# EAGLE design madrescheda (EAGLE 5.09)

## Sheet 1 of 3
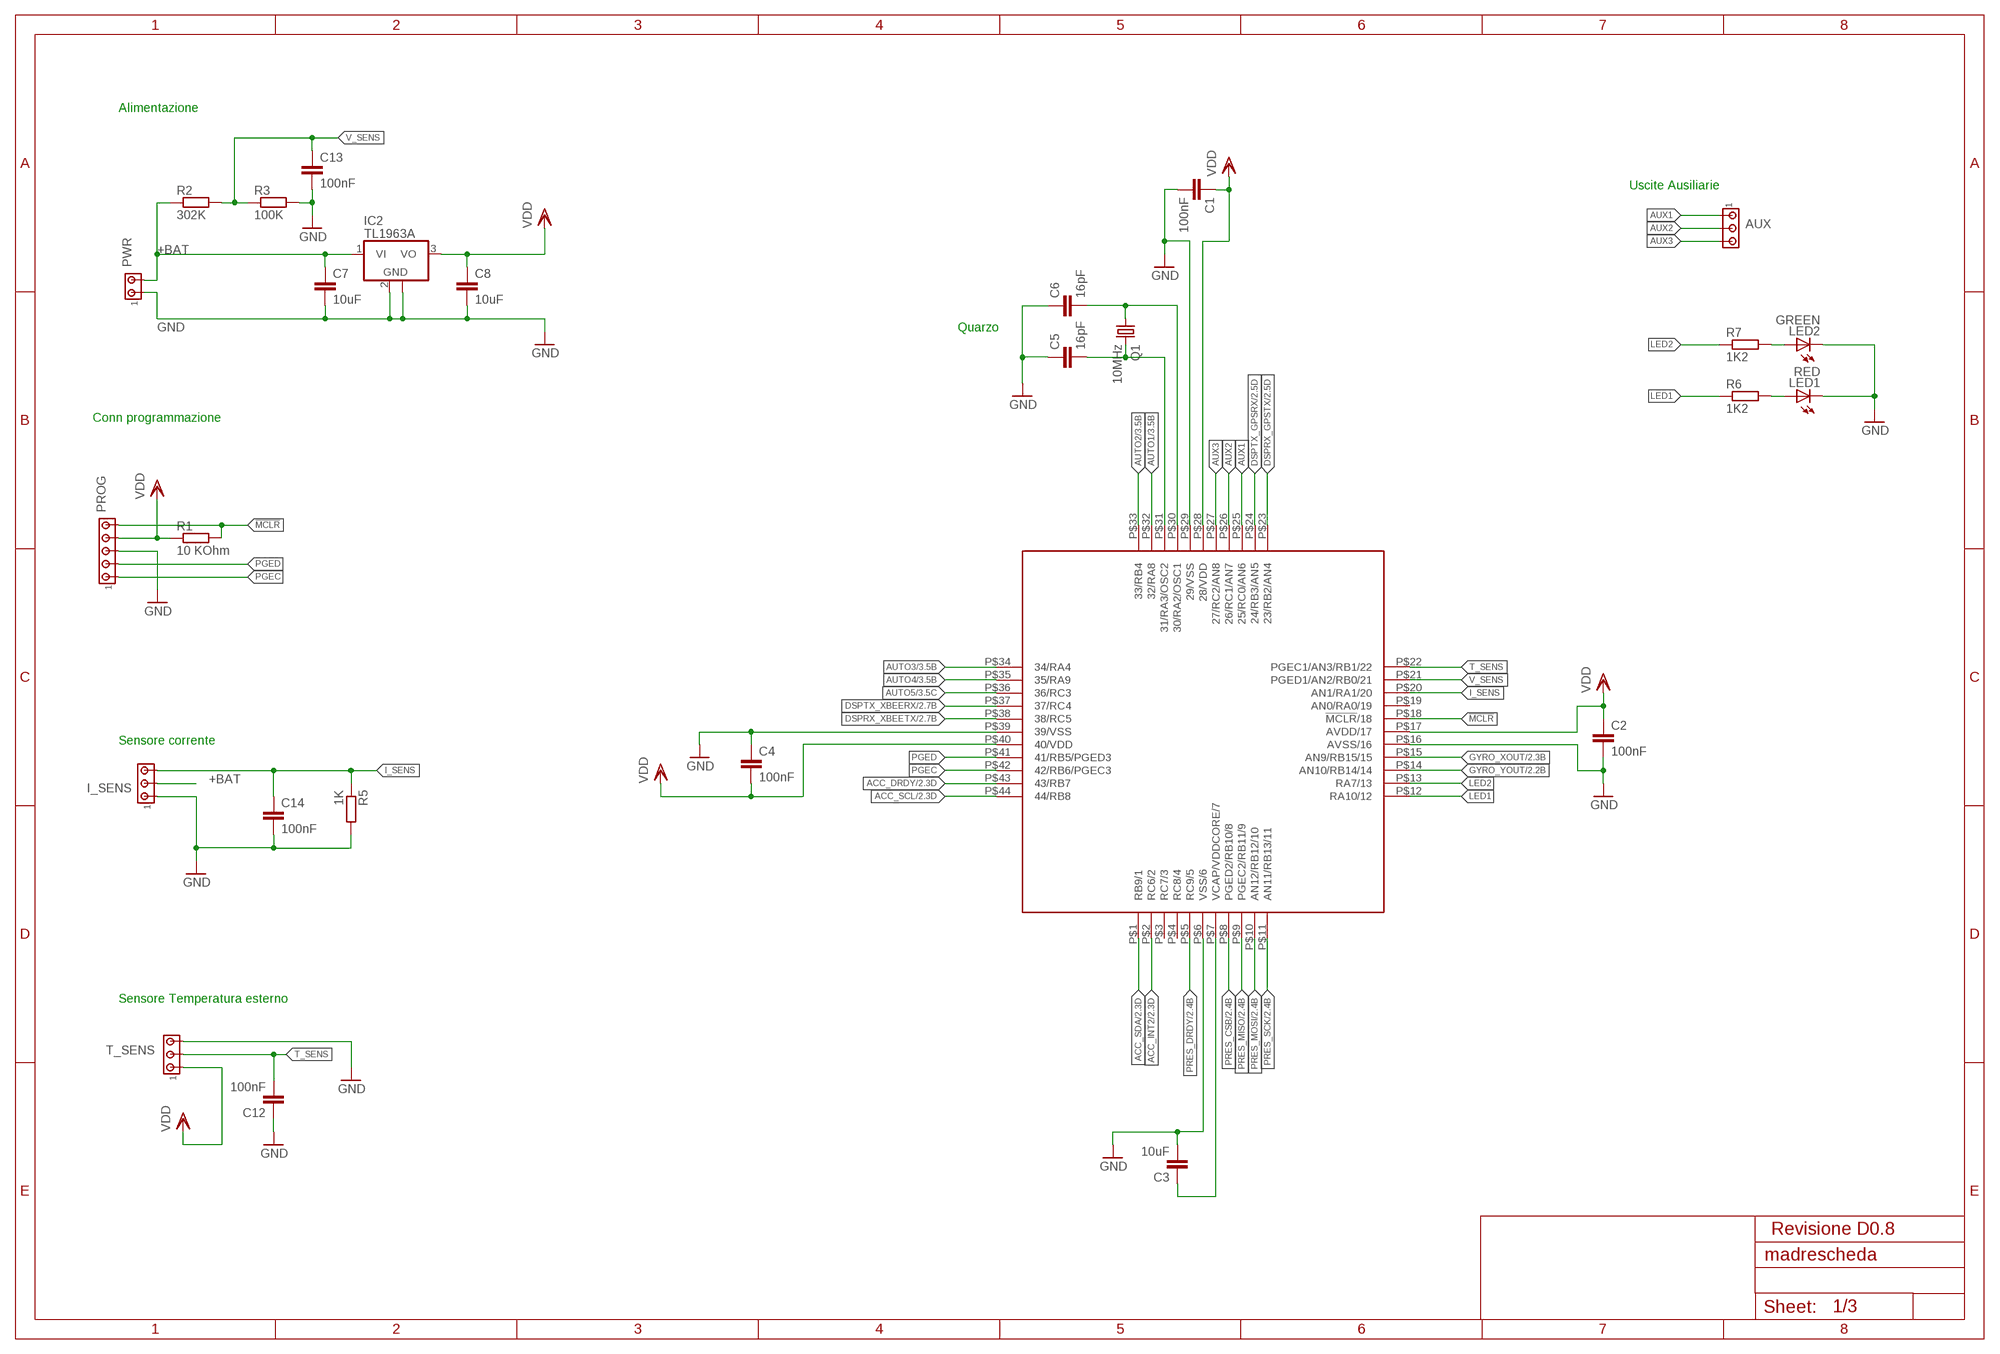
[diagram p0: schematic, sheet 1]

### Parts
AUX  MTA03-100  [10X03MTA]
C1  100nF  C-EUC0805K  [C0805K]
C2  100nF  C-EUC0805K  [C0805K]
C3  10uF  C-EUC0805K  [C0805K]
C4  100nF  C-EUC0805K  [C0805K]
C5  16pF  C-EUC0805K  [C0805K]
C6  16pF  C-EUC0805K  [C0805K]
C7  10uF  C-EUC0805K  [C0805K]
C8  10uF  C-EUC0805K  [C0805K]
C12  100nF  C-EUC0805K  [C0805K]
C13  100nF  C-EUC0805K  [C0805K]
C14  100nF  C-EUC0805K  [C0805K]
I_SENS  MTA03-100  [10X03MTA]
IC1  DSPIC33FJ128GP804TQFP  [DSPIC33FJ128GP804]
IC2  TL1963A  UA78M05DCY  [SOT223]
LED1  RED  LEDLSU260  [LSU260]
LED2  GREEN  LEDLSU260  [LSU260]
PROG  MTA05-100  [10X05MTA]
PWR  MTA02-100  [10X02MTA]
Q1  10MHz  CRYSTALHC49S  [HC49/S]
R1  10 KOhm  R-EU_0204/2V  [0204V]
R2  302K  R-EU_0204/2V  [0204V]
R3  100K  R-EU_0204/2V  [0204V]
R5  1K  R-EU_0204/2V  [0204V]
R6  1K2  R-EU_0204/2V  [0204V]
R7  1K2  R-EU_0204/2V  [0204V]
T_SENS  MTA03-100  [10X03MTA]

### Nets
!MCLR!: IC1.P$18(!MCLR!/18) PROG.5 R1.2
+BAT: C7.1 I_SENS.2 IC2.1(VI) PWR.2 R2.1
ACC_DRDY: IC1.P$43(43/RB7) ; also sheet 2
ACC_INT2: IC1.P$2(RC6/2) ; also sheet 2
ACC_SCL: IC1.P$44(44/RB8) ; also sheet 2
ACC_SDA: IC1.P$1(RB9/1) ; also sheet 2
AUTO1: IC1.P$32(32/RA8) ; also sheet 3
AUTO2: IC1.P$33(33/RB4) ; also sheet 3
AUTO3: IC1.P$34(34/RA4) ; also sheet 3
AUTO4: IC1.P$35(35/RA9) ; also sheet 3
AUTO5: IC1.P$36(36/RC3) ; also sheet 3
AUX1: AUX.1 IC1.P$25(25/RC0/AN6)
AUX2: AUX.2 IC1.P$26(26/RC1/AN7)
AUX3: AUX.3 IC1.P$27(27/RC2/AN8)
DSPRX_GPSTX: IC1.P$23(23/RB2/AN4) ; also sheet 2
DSPRX_XBEETX: IC1.P$38(38/RC5) ; also sheet 2
DSPTX_GPSRX: IC1.P$24(24/RB3/AN5) ; also sheet 2
DSPTX_XBEERX: IC1.P$37(37/RC4) ; also sheet 2
GND: C1.2 C2.2 C3.2 C4.1 C5.1 C6.1 C7.2 C8.2 C12.1 C13.2 C14.2 I_SENS.1 IC1.P$6(VSS/6) IC1.P$16(AVSS/16) IC1.P$29(29/VSS) IC1.P$39(39/VSS) IC2.2(GND) IC2.4(GND) LED1.K(C) LED2.K(C) PROG.3 PWR.1 R3.2 R5.2 T_SENS.3 ; also sheet 2,3
GYRO_XOUT: IC1.P$15(AN9/RB15/15) ; also sheet 2
GYRO_YOUT: IC1.P$14(AN10/RB14/14) ; also sheet 2
I_SENS: C14.1 I_SENS.3 IC1.P$20(AN1/RA1/20) R5.1
LED1: IC1.P$12(RA10/12) R6.1
LED2: IC1.P$13(RA7/13) R7.1
N$1: C3.1 IC1.P$7(VCAP/VDDCORE/7)
N$2: C6.2 IC1.P$30(30/RA2/OSC1) Q1.1
N$5: C5.2 IC1.P$31(31/RA3/OSC2) Q1.2
N$6: LED2.A R7.2
N$7: LED1.A R6.2
PGEC: IC1.P$42(42/RB6/PGEC3) PROG.1
PGED: IC1.P$41(41/RB5/PGED3) PROG.2
PRES_CSB: IC1.P$8(PGED2/RB10/8) ; also sheet 2
PRES_DRDY: IC1.P$5(RC9/5) ; also sheet 2
PRES_MISO: IC1.P$9(PGEC2/RB11/9) ; also sheet 2
PRES_MOSI: IC1.P$10(AN12/RB12/10) ; also sheet 2
PRES_SCK: IC1.P$11(AN11/RB13/11) ; also sheet 2
T_SENS: C12.2 IC1.P$22(PGEC1/AN3/RB1/22) T_SENS.2
V_SENS: C13.1 IC1.P$21(PGED1/AN2/RB0/21) R2.2 R3.1
VDD: C1.1 C2.1 C4.2 C8.1 IC1.P$17(AVDD/17) IC1.P$28(28/VDD) IC1.P$40(40/VDD) IC2.3(VO) PROG.4 R1.1 T_SENS.1 ; also sheet 2
Unconnected: IC1.P$3(RC7/3) IC1.P$4(RC8/4) IC1.P$19(AN0/RA0/19)

### Notes on the sheet
- Alimentazione
- Uscite Ausiliarie
- Quarzo
- Conn programmazione
- Sensore corrente
- Sensore Temperatura esterno
- Revisione D0.8

## Sheet 2 of 3
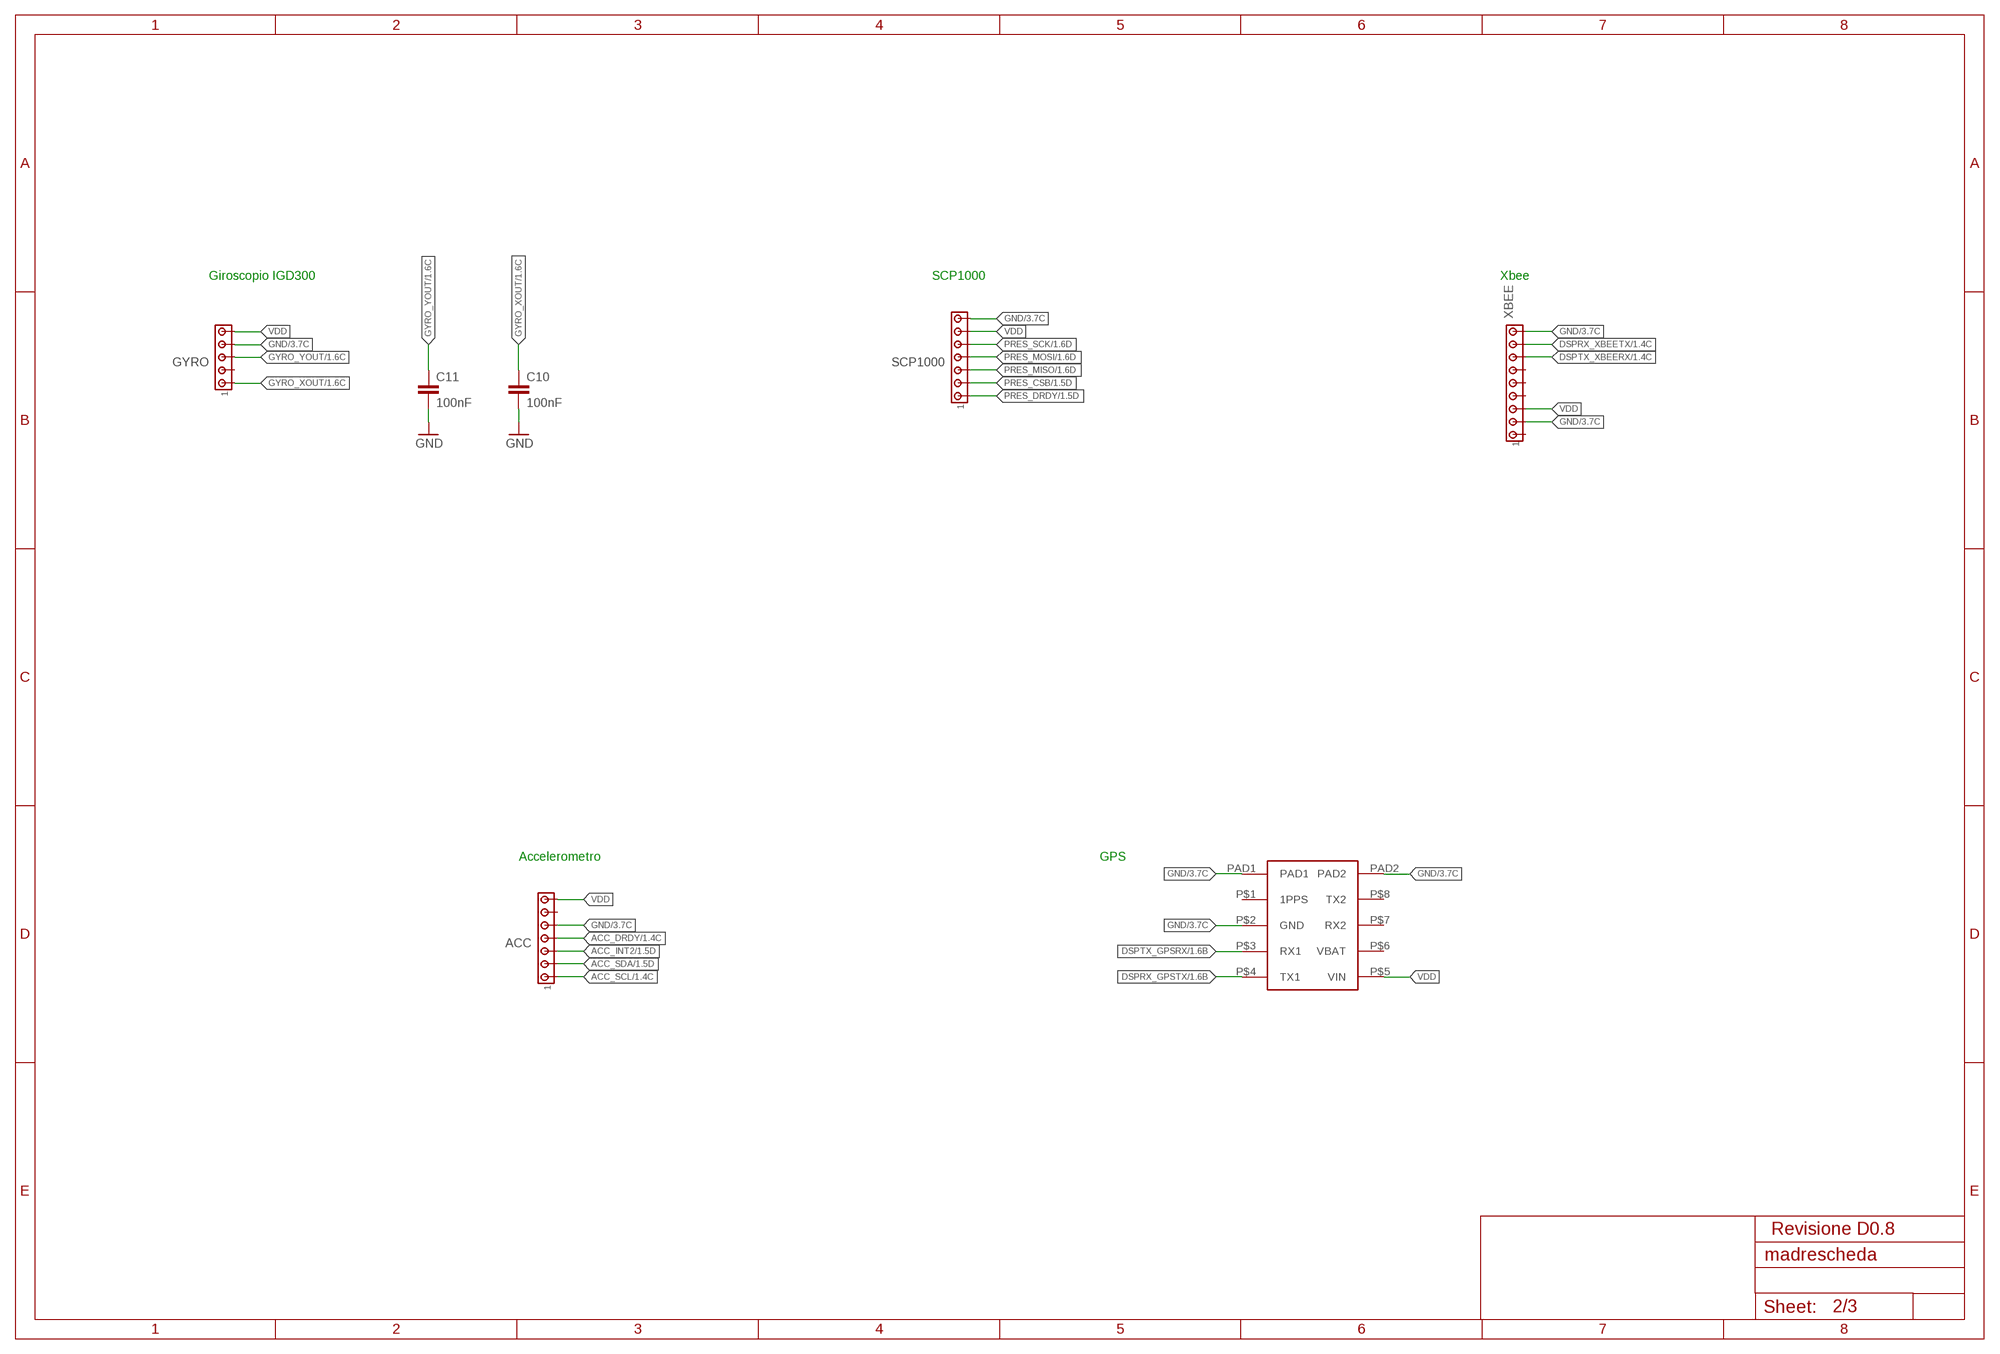
[diagram p1: schematic, sheet 2]

### Parts
ACC  MTA07-100  [10X07MTA]
C10  100nF  C-EUC0805K  [C0805K]
C11  100nF  C-EUC0805K  [C0805K]
GPS  CONN_FV-M8  [CONN_FV-M8_SMD]
GYRO  MTA05-100  [10X05MTA]
SCP1000  MTA07-100  [10X07MTA]
XBEE  MTA09-100  [10X09MTA]

### Nets
ACC_DRDY: ACC.4 ; also sheet 1
ACC_INT2: ACC.3 ; also sheet 1
ACC_SCL: ACC.1 ; also sheet 1
ACC_SDA: ACC.2 ; also sheet 1
DSPRX_GPSTX: GPS.P$4(TX1) ; also sheet 1
DSPRX_XBEETX: XBEE.8 ; also sheet 1
DSPTX_GPSRX: GPS.P$3(RX1) ; also sheet 1
DSPTX_XBEERX: XBEE.7 ; also sheet 1
GND: ACC.5 C10.2 C11.2 GPS.P$2(GND) GPS.PAD1 GPS.PAD2 GYRO.4 SCP1000.7 XBEE.2 XBEE.9 ; also sheet 1,3
GYRO_XOUT: C10.1 GYRO.1 ; also sheet 1
GYRO_YOUT: C11.1 GYRO.3 ; also sheet 1
PRES_CSB: SCP1000.2 ; also sheet 1
PRES_DRDY: SCP1000.1 ; also sheet 1
PRES_MISO: SCP1000.3 ; also sheet 1
PRES_MOSI: SCP1000.4 ; also sheet 1
PRES_SCK: SCP1000.5 ; also sheet 1
VDD: ACC.7 GPS.P$5(VIN) GYRO.5 SCP1000.6 XBEE.3 ; also sheet 1
Unconnected: ACC.6 GPS.P$1(1PPS) GPS.P$6(VBAT) GPS.P$7(RX2) GPS.P$8(TX2) GYRO.2 XBEE.1 XBEE.4 XBEE.5 XBEE.6

### Notes on the sheet
- Giroscopio IGD300 | SCP1000 | Xbee
- Accelerometro | GPS
- Revisione D0.8

## Sheet 3 of 3
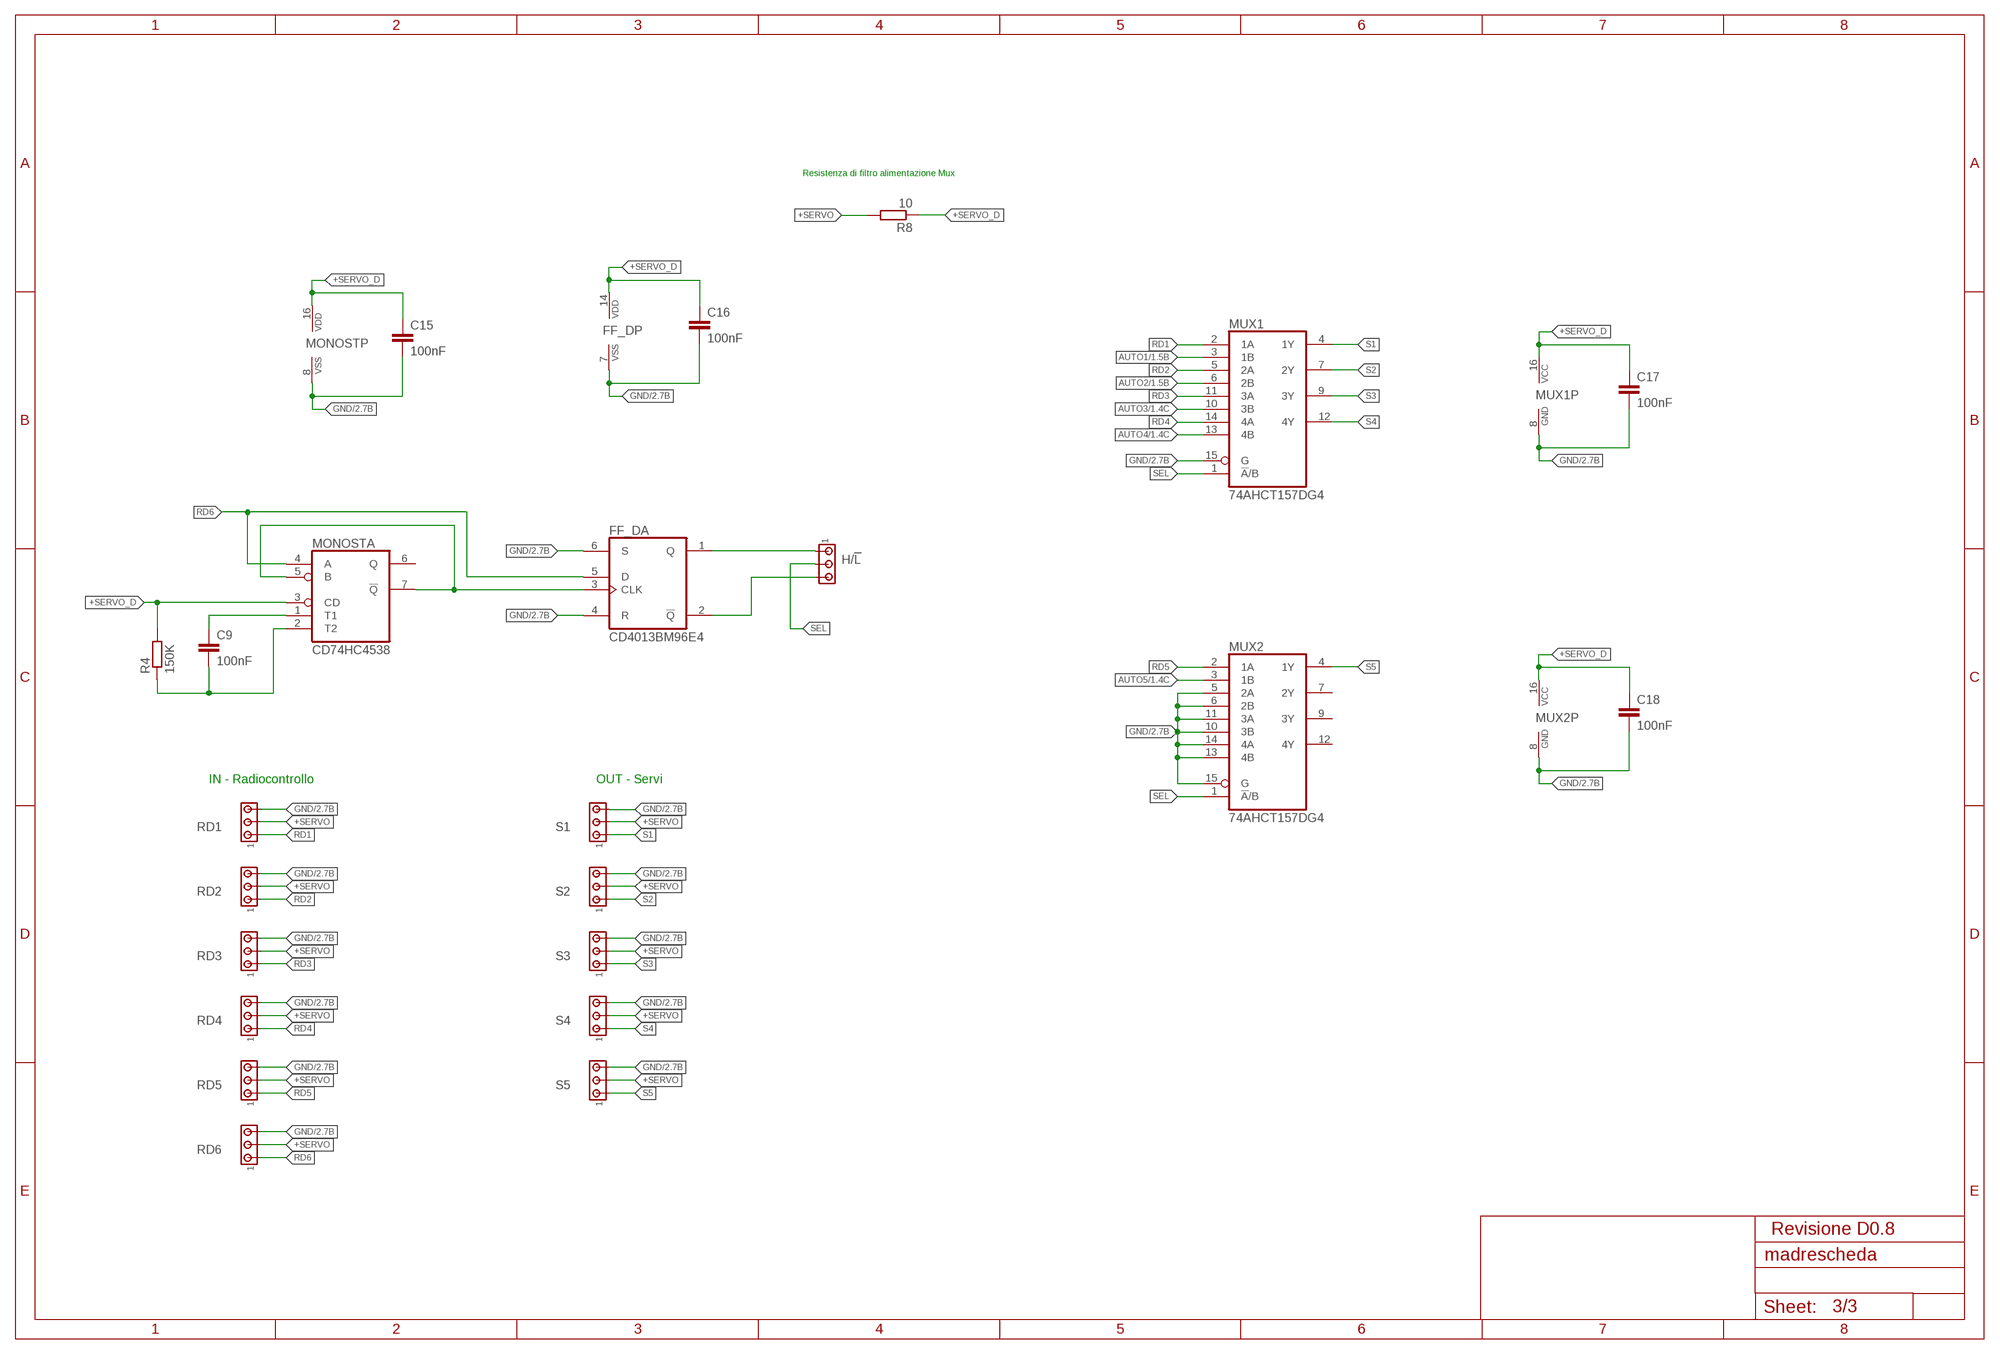
[diagram p2: schematic, sheet 3]

### Parts
C9  100nF  C-EUC0805K  [C0805K]
C15  100nF  C-EUC0805K  [C0805K]
C16  100nF  C-EUC0805K  [C0805K]
C17  100nF  C-EUC0805K  [C0805K]
C18  100nF  C-EUC0805K  [C0805K]
FF_D  CD4013BM96E4  4013D  [SO14]
H/!L  MTA03-100  [10X03MTA]
MONOST  CD74HC4538  4538D  [SO16]
MUX1  74AHCT157DG4  74AC257D  [SO16]
MUX2  74AHCT157DG4  74AC257D  [SO16]
R4  150K  R-EU_0204/2V  [0204V]
R8  10  R-EU_0204/2V  [0204V]
RD1  MTA03-100  [10X03MTA]
RD2  MTA03-100  [10X03MTA]
RD3  MTA03-100  [10X03MTA]
RD4  MTA03-100  [10X03MTA]
RD5  MTA03-100  [10X03MTA]
RD6  MTA03-100  [10X03MTA]
S1  MTA03-100  [10X03MTA]
S2  MTA03-100  [10X03MTA]
S3  MTA03-100  [10X03MTA]
S4  MTA03-100  [10X03MTA]
S5  MTA03-100  [10X03MTA]

### Nets
+SERVO: R8.2 RD1.2 RD2.2 RD3.2 RD4.2 RD5.2 RD6.2 S1.2 S2.2 S3.2 S4.2 S5.2
+SERVO_D: C15.1 C16.1 C17.1 C18.1 FF_D.14(P:VDD) MONOST.3(A:CD) MONOST.16(P:VDD) MUX1.16(VCC) MUX2.16(VCC) R4.2 R8.1
AUTO1: MUX1.3(1B) ; also sheet 1
AUTO2: MUX1.6(2B) ; also sheet 1
AUTO3: MUX1.10(3B) ; also sheet 1
AUTO4: MUX1.13(4B) ; also sheet 1
AUTO5: MUX2.3(1B) ; also sheet 1
CLK: FF_D.3(A:CLK) MONOST.5(A:B) MONOST.7(A:!Q)
GND: C15.2 C16.2 C17.2 C18.2 FF_D.4(A:R) FF_D.6(A:S) FF_D.7(P:VSS) MONOST.8(P:VSS) MUX1.8(GND) MUX1.15(G) MUX2.5(2A) MUX2.6(2B) MUX2.8(GND) MUX2.10(3B) MUX2.11(3A) MUX2.13(4B) MUX2.14(4A) MUX2.15(G) RD1.3 RD2.3 RD3.3 RD4.3 RD5.3 RD6.3 S1.3 S2.3 S3.3 S4.3 S5.3 ; also sheet 1,2
N$9: C9.2 MONOST.2(A:T2) R4.1
N$10: C9.1 MONOST.1(A:T1)
N$13: FF_D.1(A:Q) H/!L.1
N$14: FF_D.2(A:!Q) H/!L.3
RD1: MUX1.2(1A) RD1.1
RD2: MUX1.5(2A) RD2.1
RD3: MUX1.11(3A) RD3.1
RD4: MUX1.14(4A) RD4.1
RD5: MUX2.2(1A) RD5.1
RD6: FF_D.5(A:D) MONOST.4(A:A) RD6.1
S1: MUX1.4(1Y) S1.1
S2: MUX1.7(2Y) S2.1
S3: MUX1.9(3Y) S3.1
S4: MUX1.12(4Y) S4.1
S5: MUX2.4(1Y) S5.1
SEL: H/!L.2 MUX1.1(!A!/B) MUX2.1(!A!/B)
Unconnected: FF_D.8(B:S) FF_D.9(B:D) FF_D.10(B:R) FF_D.11(B:CLK) FF_D.12(B:!Q) FF_D.13(B:Q) MONOST.6(A:Q) MONOST.9(B:!Q) MONOST.10(B:Q) MONOST.11(B:B) MONOST.12(B:A) MONOST.13(B:CD) MONOST.14(B:T2) MONOST.15(B:T1) MUX2.7(2Y) MUX2.9(3Y) MUX2.12(4Y)

### Notes on the sheet
- Resistenza di filtro alimentazione Mux
- IN - Radiocontrollo | OUT - Servi
- Revisione D0.8

## Library data of the parts
ACC SCP1000 = con-amp:MTA07-100: AMP connector
AUX H/!L I_SENS RD1-RD6 S1-S5 T_SENS = con-amp:MTA03-100: AMP connector
C1-C4 C7 C8 C13 C14 = resistor:C-EU: CAPACITOR, European symbol
C5 C6 C9-C12 C15-C18 = rcl:C-EU: CAPACITOR, European symbol
FF_D = 40xx:4013: Dual D FLIP FLOP, set/reset
GPS = gps:CONN_FV-M8
GYRO PROG = con-amp:MTA05-100: AMP connector
IC1 = UavComp:DSPIC33FJ128GP804: dsPic33fl128GP804
IC2 = linear:UA78M*: POSITIVE-VOLTAGE REGULATORS Source: http://focus.ti.com/lit/ds/symlink/ua78m33.pdf
LED1 LED2 = led:LED: LED OSRAM: - CHIPLED LG R971, LG N971, LY N971, LG Q971, LY Q971, LO R971, LY R971 LH N974, LH R974 LS Q976, LO Q976, LY Q976 LO Q996 - Hyper CHIPLED LW Q18S LB Q993, LB Q99A, LB R99A - SideLED LS A670, LO A670, LY A670, LG A670, LP A670 LB A673, LV A673, LT A673, LW A673 LH A674 LY A675 LS A676, LA A676, LO A676, LY A676, LW A676 LS A679, LY A679, LG A679 - Hyper Micro SIDELED® LS Y876, LA Y876, LO Y876, LY Y876 LT Y87S - SmartLED LW L88C, LW L88S LB L89C, LB L89S, LG L890 LS L89K, LO L89K, LY L89K LS L896, LA L896, LO L896, LY L896 - TOPLED LS T670, LO T670, LY T670, LG T670, LP T670 LSG T670, LSP T670, LSY T670, LOP T670, LYG T670 LG T671, LOG T671, LSG T671 LB T673, LV T673, LT T673, LW T673 LH T674 LS T676, LA T676, LO T676, LY T676, LB T676, LH T676, LSB T676, LW T676 LB T67C, LV T67C, LT T67C, LS T67K, LO T67K, LY T67K, LW E67C LS E67B, LA E67B, LO E67B, LY E67B, LB E67C, LV E67C, LT E67C LW T67C LS T679, LY T679, LG T679 LS T770, LO T770, LY T770, LG T770, LP T770 LB T773, LV T773, LT T773, LW T773 LH T774 LS E675, LA E675, LY E675, LS T675 LS T776, LA T776, LO T776, LY T776, LB T776 LHGB T686 LT T68C, LB T68C - Hyper Mini TOPLED® LB M676 - Mini TOPLED Santana® LG M470 LS M47K, LO M47K, LY M47K Source: http://www.osram.convergy.de LUXEON: - LUMILED® LXK2-PW12-R00, LXK2-PW12-S00, LXK2-PW14-U00, LXK2-PW14-V00 LXK2-PM12-R00, LXK2-PM12-S00, LXK2-PM14-U00 LXK2-PE12-Q00, LXK2-PE12-R00, LXK2-PE12-S00, LXK2-PE14-T00, LXK2-PE14-U00 LXK2-PB12-K00, LXK2-PB12-L00, LXK2-PB12-M00, LXK2-PB14-N00, LXK2-PB14-P00, LXK2-PB14-Q00 LXK2-PR12-L00, LXK2-PR12-M00, LXK2-PR14-Q00, LXK2-PR14-R00 LXK2-PD12-Q00, LXK2-PD12-R00, LXK2-PD12-S00 LXK2-PH12-R00, LXK2-PH12-S00 LXK2-PL12-P00, LXK2-PL12-Q00, LXK2-PL12-R00 Source: www.luxeon.com KINGBRIGHT: KA-3528ASYC Source: www.kingbright.com
MONOST = 45xx:4538: Dual precision monostable MULTIVIBRATOR
MUX1 MUX2 = 74xx-eu:74*257: Quadruple 2-to 1 line data SELECTOR/MULTIPLEXER
PWR = con-amp:MTA02-100: AMP connector
Q1 = crystal:CRYSTAL: CRYSTAL
R1-R8 = rcl:R-EU_: RESISTOR, European symbol
XBEE = con-amp:MTA09-100: AMP connector

## Board
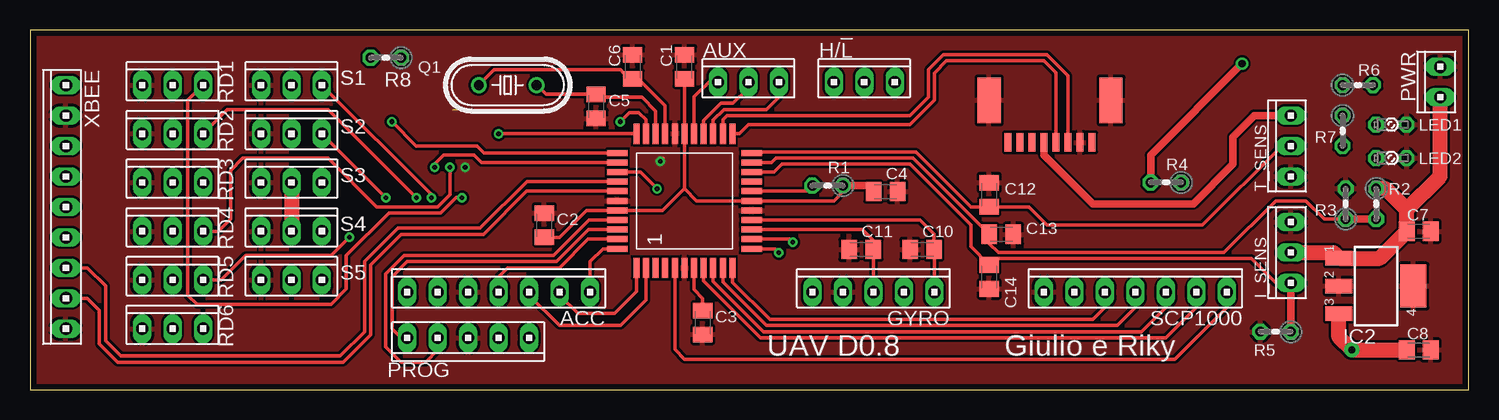
[diagram p3: board, top side]
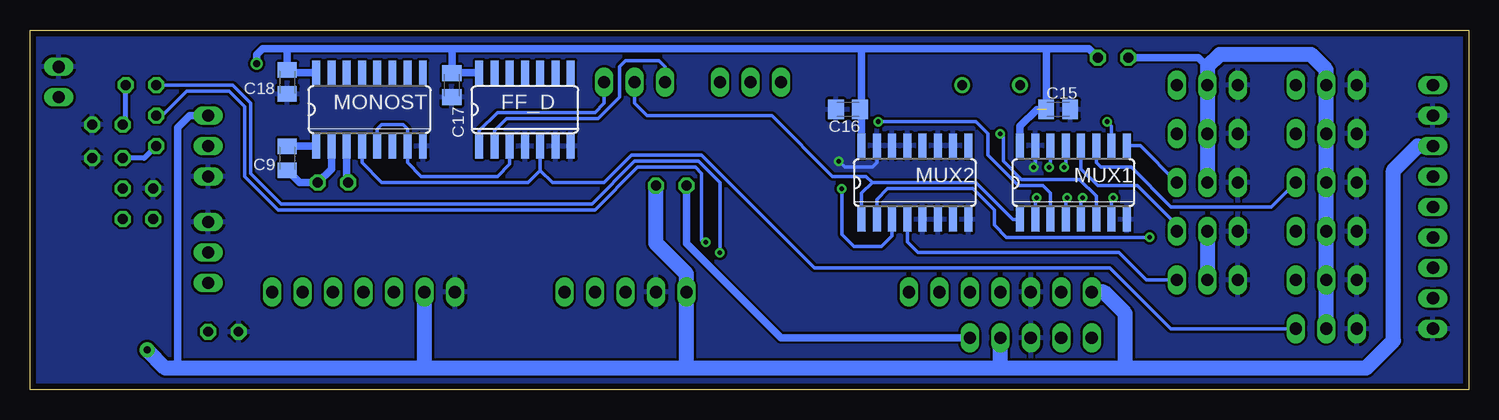
[diagram p4: board, bottom side, seen from below]

Size 119.95 x 30 mm. Coordinates in mm from the lower left corner, seen from the top.
Outline: 119.95,0 119.95,30 0,30 0,0 119.95,0
Copper layers (1*16): Top 0.035mm / dielectric 1.5mm / Bottom 0.035mm
Design rules "default *": minimum track width 10mil, minimum drill 15mil, track to track 8mil, track to pad 8mil, pad to pad 8mil, via to via 8mil, smd to smd 8mil, copper to edge 20mil, drill to drill 8mil, minimum pad ring 10mil, minimum via ring 8mil, stop-mask expansion 4mil, vias tented up to drill 0mil, thermal gap 10mil

### Footprints (pad centres in the part's own frame; a part is rotated, then mirrored left to right if it is on the bottom)
10X07MTA = drill 1.016 long: 1 7.62,0; 2 5.08,0; 3 2.54,0; 4 0,0; 5 -2.54,0; 6 -5.08,0; 7 -7.62,0
10X03MTA = drill 1.016 long: 1 2.54,0; 2 0,0; 3 -2.54,0
C0805K = smd 1.3 x 1.6: 1 -1,0; 2 1,0
SO14 = smd 0.66 x 2.032: 1 -3.81,-3.073; 2 -2.54,-3.073; 3 -1.27,-3.073; 4 0,-3.073; 5 1.27,-3.073; 6 2.54,-3.073; 7 3.81,-3.073; 8 3.81,3.073; 9 2.54,3.073; 10 1.27,3.073; 11 0,3.073; 12 -1.27,3.073; 13 -2.54,3.073; 14 -3.81,3.073
CONN_FV-M8_SMD = smd 0.6 x 1.55: P$1 -4,3; P$2 -3,3; P$3 -2,3; P$4 -1,3; P$5 0,3; P$6 1,3; P$7 2,3; P$8 3,3 | smd 1.93 x 3.81: PAD1 -5.588,-0.508; PAD2 4.572,-0.508
10X05MTA = drill 1.016 long: 1 5.08,0; 2 2.54,0; 3 0,0; 4 -2.54,0; 5 -5.08,0
DSPIC33FJ128GP804 = smd 1.7 x 0.5: P$1 -5.6,4; P$2 -5.6,3.2; P$3 -5.6,2.4; P$4 -5.6,1.6; P$5 -5.6,0.8; P$6 -5.6,0; P$7 -5.6,-0.8; P$8 -5.6,-1.6; P$9 -5.6,-2.4; P$10 -5.6,-3.2; P$11 -5.6,-4; P$23 5.6,-4; P$24 5.6,-3.2; P$25 5.6,-2.4; P$26 5.6,-1.6; P$27 5.6,-0.8; P$28 5.6,0; P$29 5.6,0.8; P$30 5.6,1.6; P$31 5.6,2.4; P$32 5.6,3.2; P$33 5.6,4 | smd 0.5 x 1.7: P$12 -4,-5.6; P$13 -3.2,-5.6; P$14 -2.4,-5.6; P$15 -1.6,-5.6; P$16 -0.8,-5.6; P$17 0,-5.6; P$18 0.8,-5.6; P$19 1.6,-5.6; P$20 2.4,-5.6; P$21 3.2,-5.6; P$22 4,-5.6; P$34 4,5.6; P$35 3.2,5.6; P$36 2.4,5.6; P$37 1.6,5.6; P$38 0.8,5.6; P$39 0,5.6; P$40 -0.8,5.6; P$41 -1.6,5.6; P$42 -2.4,5.6; P$43 -3.2,5.6; P$44 -4,5.6
SOT223 = smd 1.219 x 2.235: 1 -2.311,-3.099; 2 0,-3.099; 3 2.311,-3.099 | smd 3.6 x 2.2: 4 0,3.099
LSU260 = drill 0.813 octagon: A -1.27,0; K 1.27,0
SO16 = smd 0.66 x 2.032: 1 -4.445,-3.073; 2 -3.175,-3.073; 3 -1.905,-3.073; 4 -0.635,-3.073; 5 0.635,-3.073; 6 1.905,-3.073; 7 3.175,-3.073; 8 4.445,-3.073; 9 4.445,3.073; 10 3.175,3.073; 11 1.905,3.073; 12 0.635,3.073; 13 -0.635,3.073; 14 -1.905,3.073; 15 -3.175,3.073; 16 -4.445,3.073
10X02MTA = drill 1.016 long: 1 1.27,0; 2 -1.27,0
HC49/S = drill 0.813 round: 1 -2.413,0; 2 2.413,0
0204V = drill 0.813 octagon: 1 -1.27,0; 2 1.27,0
10X09MTA = drill 1.016 long: 1 10.16,0; 2 7.62,0; 3 5.08,0; 4 2.54,0; 5 0,0; 6 -2.54,0; 7 -5.08,0; 8 -7.62,0; 9 -10.16,0

### Placement (x,y rotation side)
ACC  39.06,8.13 0 top
AUX  59.89,25.65 0 top
C1  54.56,26.92 90 top
C2  42.87,13.72 90 top
C3  56.08,5.59 270 top
C4  71.32,16.51 180 top
C5  47.19,23.62 90 top
C6  50.24,26.92 270 top
C7  115.77,13.21 0 top
C8  115.77,3.3 0 top
C9  98.5,19.3 270 bottom
C10  74.37,11.68 180 top
C11  69.29,11.68 180 top
C12  79.96,16.26 270 top
C13  80.97,12.95 0 top
C14  79.96,9.4 270 top
C15  34.24,23.37 0 bottom
C16  51.76,23.37 180 bottom
C17  84.78,25.4 270 bottom
C18  98.5,25.65 270 bottom
FF_D  78.69,23.37 0 bottom
GPS  84.53,23.62 180 top
GYRO  70.31,8.13 0 top
H/!L  69.54,25.65 0 top
I_SENS  105.1,11.43 90 top
IC1  54.56,15.75 90 top
IC2  112.22,8.64 270 top
LED1  113.49,22.1 0 top
LED2  113.49,19.3 0 top
MONOST  91.64,23.37 0 bottom
MUX1  32.97,17.27 0 bottom
MUX2  46.18,17.27 0 bottom
PROG  36.52,4.32 180 top
PWR  117.55,25.65 90 top
Q1  39.83,25.4 0 top
R1  66.5,17.02 180 top
R2  112.22,15.49 270 top
R3  109.68,15.49 90 top
R4  94.69,17.27 180 top
R5  103.83,4.83 180 top
R6  110.69,25.4 0 top
R7  109.42,21.59 270 top
R8  29.67,27.69 180 top
RD1  11.89,25.4 0 top
RD2  11.89,21.34 0 top
RD3  11.89,17.27 0 top
RD4  11.89,13.21 0 top
RD5  11.89,9.14 0 top
RD6  11.89,5.08 0 top
S1  21.79,25.4 0 top
S2  21.79,21.34 0 top
S3  21.79,17.27 0 top
S4  21.79,13.21 0 top
S5  21.79,9.14 0 top
SCP1000  92.15,8.13 0 top
T_SENS  105.1,20.32 90 top
XBEE  3,15.24 90 top

### Tracks (layer width: path | path; a pad name or v marks a point on that pad's centre or on a via)
!MCLR!
  Top 0.305: IC1.P$18 64.76,16.55 R1.2
  Bottom 0.61: R1.2 65.23,12.19 57.35,4.32 PROG.5
+BAT
  Top 1.27: 109.14,10.95 108.66,11.43 I_SENS.2 | PWR.2 117.55,17.78 114.77,15 | 109.14,10.95 IC2.1 | 109.14,10.95 112.51,10.95 C7.1 114.77,15 | R2.1 113.01,16.76 114.77,15
+SERVO
  Top 1.27: S3.2 S4.2
  Bottom 0.61: R8.2 22.55,27.69 21.79,26.92
  Bottom 1.27: RD6.2 RD5.2 RD4.2 RD3.2 RD2.2 RD1.2 11.89,26.67 13.16,27.94 20.78,27.94 21.79,26.92 S1.2 S2.2 S3.2 | S4.2 S5.2
+SERVO_D  (via drill 0.6)  (1 unrouted)
  Top 0.61: v101.04,27.18 93.42,19.56 R4.2
  Bottom 0.61: MUX1.16 37.41,21.97 36.02,23.37 | R8.1 31.7,28.45 35.25,28.45 | 35.25,28.45 50.75,28.45 | 50.75,28.45 84.53,28.45 | 84.53,28.45 98.5,28.45 | 84.74,26.44 84.74,28.23 84.53,28.45 | 84.74,26.44 FF_D.14 | 84.74,26.44 C17.1 | C15.1 35.24,28.43 35.25,28.45 | 98.5,28.45 C18.1 98.29,26.44 MONOST.16 | v101.04,27.18 101.04,27.94 100.53,28.45 98.5,28.45 | MONOST.3 93.55,17.4 R4.2 | 50.75,28.45 50.62,28.32 50.62,23.23 | MUX2.16 50.62,22.86 50.62,23.23 | 50.62,23.23 C16.1
ACC_DRDY
  Top 0.305: IC1.P$43 46.53,12.55 44.14,10.16 39.83,10.16 39.06,9.4 ACC.4
ACC_INT2
  Top 0.305: IC1.P$2 51.36,7.47 49.22,5.33 44.14,5.33 41.6,7.87 ACC.3
ACC_SCL
  Top 0.305: IC1.P$44 47.76,11.75 46.68,10.67 ACC.1
ACC_SDA
  Top 0.305: IC1.P$1 50.56,8.19 48.72,6.35 45.67,6.35 44.14,7.87 ACC.2
AUTO1  (via drill 0.38)
  Top 0.305: IC1.P$32 51.36,22.5 50.75,23.11 49.99,23.11 v49.22,22.35
  Bottom 0.305: v49.22,22.35 41.1,22.35 40.08,21.34 40.08,19.56 37.54,17.02 35.51,17.02 34.87,16.38 MUX1.3
AUTO2  (via drill 0.38)
  Top 0.305: v39.06,21.34 50.55,21.34 IC1.P$33
  Bottom 0.305: v39.06,21.34 38.81,21.08 38.81,19.05 37.29,17.53 32.46,17.53 31.06,16.13 MUX1.6
AUTO3  (via drill 0.38)
  Top 0.305: IC1.P$34 37.86,19.75 37.29,20.32 32.21,20.32 v30.17,22.35
  Bottom 0.305: MUX1.10 29.79,21.97 v30.17,22.35
AUTO4  (via drill 0.38)
  Top 0.305: IC1.P$35 37.64,18.95 37.03,19.56 34.49,19.56 33.73,18.8 v33.73,18.54
  Bottom 0.305: MUX1.13 33.6,18.67 v33.73,18.54
AUTO5  (via drill 0.38)
  Top 0.305: IC1.P$36 50.89,18.15 v52.27,16.76
  Bottom 0.305: v52.27,16.76 52.27,12.95 51.26,11.94 48.97,11.94 48.08,12.83 MUX2.3
AUX1
  Top 0.305: IC1.P$25 56.96,22.47 57.86,23.37 61.42,23.37 62.43,24.38 AUX.1
AUX2
  Top 0.305: IC1.P$26 56.16,22.43 57.61,23.88 58.62,23.88 59.89,25.15 AUX.2
AUX3
  Top 0.305: IC1.P$27 55.36,24.42 56.59,25.65 AUX.3
CLK
  Bottom 0.305: FF_D.3 79.96,18.8 80.97,17.78 87.32,17.78 88.47,18.92 MONOST.7 88.47,21.72 88.85,22.1 90.63,22.1 91.01,21.72 MONOST.5
DSPRX_GPSTX
  Top 0.305: IC1.P$23 59.14,21.35 59.89,22.1 73.35,22.1 75.39,24.13 75.39,26.42 76.4,27.43 84.53,27.43 85.53,26.43 GPS.P$4
DSPRX_XBEETX
  Top 0.305: XBEE.8 4.77,7.62 5.79,6.6 5.79,3.81 7.31,2.29 26.11,2.29 28.4,4.57 28.4,10.41 30.94,12.95 37.79,12.95 41.39,16.55 IC1.P$38
DSPTX_GPSRX
  Top 0.305: GPS.P$3 86.53,26.19 84.78,27.94 76.15,27.94 74.88,26.67 74.88,24.38 73.35,22.86 58.11,22.86 57.76,22.5 IC1.P$24
DSPTX_XBEERX
  Top 0.305: XBEE.7 4.77,10.16 6.3,8.64 6.3,4.06 7.57,2.79 25.86,2.79 27.89,4.83 27.89,10.67 30.68,13.46 37.54,13.46 41.43,17.35 IC1.P$37
GND  (via drill 0.38)
  Top 0.305: v36.27,18.54 36.52,18.54 | v52.53,19.05 52.78,19.3
  Bottom 0.305: MUX1.15 36.14,18.67 v36.27,18.54 | MUX2.15 49.35,18.92 49.73,18.54 52.02,18.54 v52.53,19.05
  pour Bottom: -0.05,30 119.95,30 119.95,0 -0.05,0
  pour Top: -0.05,30 119.95,30 119.95,0 -0.05,0
GYRO_XOUT
  Top 0.305: IC1.P$15 74.19,14.15 75.37,12.97 C10.1 75.39,11.67 GYRO.1
GYRO_YOUT
  Top 0.305: IC1.P$14 69.4,13.35 70.29,12.46 C11.1 70.31,11.67 GYRO.3
I_SENS
  Top 0.305: IC1.P$20 62.04,18.15 62.69,18.8 73.35,18.8 78.43,13.72 78.43,11.92 C14.1 80.48,10.92 101.8,10.92 103.83,8.89 I_SENS.3
  Top 0.61: I_SENS.3 R5.1
LED1  (via drill 0.38)
  Top 0.305: IC1.P$12 62.11,11.75 v62.43,11.43
  Bottom 0.305: v62.43,11.43 62.43,17.27 64.21,19.05 69.54,19.05 73.1,15.49 99.01,15.49 101.55,18.03 101.55,23.88 103.07,25.4 R6.1
LED2  (via drill 0.38)
  Top 0.305: IC1.P$13 63.35,12.55 v63.6,12.29
  Bottom 0.305: v63.6,12.29 63.8,12.29 63.96,12.45 63.96,18.03 64.46,18.54 69.29,18.54 72.85,14.99 99.26,14.99 102.06,17.78 102.06,23.62 103.33,24.89 106.88,24.89 108.91,22.86 R7.1
N$1
  Top 0.305: IC1.P$7 55.36,8.34 56.08,7.62 C3.1
N$2
  Top 0.305: IC1.P$30 52.96,23.7 50.75,25.91 50.26,25.91 C6.2 49.75,26.42 49.48,26.42 49.22,26.67 38.68,26.67 Q1.1
N$5
  Top 0.305: IC1.P$31 52.16,23.23 51,24.38 47.43,24.38 C5.2 47.18,24.64 43,24.64 Q1.2
N$6
  Bottom 0.406: R7.2 110.44,19.3 LED2.A
N$7
  Bottom 0.406: LED1.A 111.96,22.35 R6.2
N$9
  Bottom 0.61: MONOST.2 94.82,18.41 R4.1 97.47,17.27 C9.2
N$10
  Bottom 0.61: MONOST.1 C9.1
N$13
  Bottom 0.305: H/!L.1 72.08,23.88 72.85,23.11 80.97,23.11 82.5,21.59 FF_D.1
N$14
  Bottom 0.305: FF_D.2 81.23,21.59 80.21,22.61 72.59,22.61 70.81,24.38 70.81,26.92 70.31,27.43 67.51,27.43 67,26.92 H/!L.3
PGEC
  Top 0.305: IC1.P$42 46.57,13.35 43.89,10.67 31.44,10.67 30.17,9.4 30.17,5.08 30.94,4.32 PROG.1
PGED
  Top 0.305: IC1.P$41 46.61,14.15 43.64,11.18 31.19,11.18 29.67,9.65 29.67,3.56 30.94,2.29 32.97,2.29 33.98,3.3 PROG.2
PRES_CSB
  Top 0.305: IC1.P$8 56.16,9.07 60.91,4.32 94.69,4.32 97.23,6.86 SCP1000.2
PRES_DRDY
  Top 0.305: IC1.P$5 53.76,3.34 54.56,2.54 95.45,2.54 99.77,6.86 SCP1000.1
PRES_MISO
  Top 0.305: IC1.P$9 56.96,9.03 61.16,4.83 92.66,4.83 94.69,6.86 SCP1000.3
PRES_MOSI
  Top 0.305: IC1.P$10 57.76,8.99 61.42,5.33 90.63,5.33 92.15,6.86 SCP1000.4
PRES_SCK
  Top 0.305: IC1.P$11 58.56,8.95 61.67,5.84 88.59,5.84 89.61,6.86 SCP1000.5
RD1  (via drill 0.38)
  Top 0.305: RD1.1 13.16,24.13 13.16,7.87 13.92,7.11 25.09,7.11 26.36,8.38 26.36,11.18 29.92,14.73 34.24,14.73 35.51,16 v36.02,16
  Bottom 0.305: MUX1.2 36.14,15.88 v36.02,16
RD2  (via drill 0.38)
  Top 0.305: v32.21,16 24.84,23.37 16.46,23.37 RD2.1
  Bottom 0.305: MUX1.5 32.33,15.88 v32.21,16
RD3
  Bottom 0.305: MUX1.11 31.06,18.92 30.68,18.54 28.14,18.54 24.84,15.24 16.46,15.24 RD3.1
RD4  (via drill 0.38)
  Top 0.305: RD4.1 15.7,13.21 16.71,14.22 16.71,18.29 17.73,19.3 24.84,19.3 28.9,15.24 33.98,15.24 35,16.26 v35,18.54
  Bottom 0.305: MUX1.14 34.87,18.67 v35,18.54
RD5  (via drill 0.38)
  Top 0.305: RD5.1 15.95,9.14 17.98,11.18 25.09,11.18 v26.62,12.7
  Bottom 0.305: MUX2.2 49.35,15.88 48.46,16.76 41.35,16.76 39.57,14.99 39.57,13.72 38.56,12.7 v26.62,12.7
RD6
  Bottom 0.305: 77.42,18.29 FF_D.5 | 77.42,18.29 78.43,17.27 90.63,17.27 92.28,18.92 MONOST.4 | RD6.1 24.84,5.08 29.92,10.16 54.56,10.16 63.96,19.56 69.8,19.56 72.08,17.27 76.4,17.27 77.42,18.29
S1  (via drill 0.38)
  Top 0.305: v33.48,16 33.48,16.26 S1.1
  Bottom 0.305: MUX1.4 33.6,16.13 v33.48,16
S2  (via drill 0.38)
  Top 0.305: v29.67,16 S2.1
  Bottom 0.305: MUX1.7 29.79,15.88 v29.67,16
S3
  Bottom 0.305: MUX1.9 27.41,20.34 S3.1
S4
  Bottom 0.305: MUX1.12 32.33,18.41 30.94,17.02 27.63,17.02 24.33,13.72 S4.1
S5
  Bottom 0.305: S5.1 26.87,9.14 29.16,11.43 45.92,11.43 46.81,12.32 MUX2.4
SEL
  Bottom 0.305: H/!L.2 69.54,23.88 68.53,22.86 58.11,22.86 53.03,17.78 50.24,17.78 49.73,17.27 | 49.73,17.27 50.62,16.38 MUX2.1 | MUX1.1 38.02,14.2 41.1,17.27 49.73,17.27
T_SENS
  Top 0.305: IC1.P$22 60.22,19.81 73.86,19.81 78.43,15.24 79.94,15.24 C12.2 79.97,15.24 83.26,15.24 84.78,13.72 97.74,13.72 104.34,20.32 T_SENS.2
V_SENS
  Top 0.305: IC1.P$21 61.82,18.95 62.18,19.3 73.62,19.3 C13.1 | R3.1 107.9,14.22 106.37,15.75 103.83,15.75 99.52,11.43 80.72,11.43 79.96,12.19 79.96,12.94 C13.1 | C13.1 79.96,12.95
  Top 0.61: R3.1 R2.2
VDD  (via drill 0.6 pad 1.27)
  Top 0.305: R1.1 67.77,16.51 67,15.75 IC1.P$17 55.57,15.75 54.56,16.76 | 54.56,16.76 52.74,14.95 IC1.P$40 46.39,14.95 44.14,12.7 42.89,12.7 C2.1 | 54.56,16.76 IC1.P$28 C1.1
  Top 0.61: GPS.P$5 84.53,19.56 88.59,15.49 96.98,15.49 100.28,18.8 100.28,21.08 102.06,22.86 T_SENS.1 105.61,22.86 | C4.2 70.32,16.75 70.05,17.02 R1.1
  Top 1.27: IC2.3 109.12,4.37 v110.18,3.3 C8.1
  Bottom 0.61: T_SENS.1 106.63,22.86 107.64,21.84 107.64,1.78
  Bottom 1.27: R1.1 67.77,12.19 65.23,9.65 GYRO.5 65.23,1.78 | 65.23,1.78 86.82,1.78 | SCP1000.6 87.07,2.03 86.82,1.78 | 39.06,1.78 65.23,1.78 | 39.06,1.78 PROG.4 | 28.65,1.78 39.06,1.78 | ACC.7 30.43,8.13 28.65,6.35 28.65,1.78 | XBEE.3 4.27,20.32 6.3,18.29 6.3,4.06 8.58,1.78 28.65,1.78 | 86.82,1.78 107.64,1.78 108.66,1.78 v110.18,3.3

### Text on the board
tNames: UAV D0.8 | Giulio e Riky